# Altium project PCB_Project.PrjPcb (part 4 of 11)

## Sheet УШЯИ.411618.029Э Э3 Лист 2.schdoc
size 594 x 420 mm; SheetNumber: 2; SheetTotal: 7
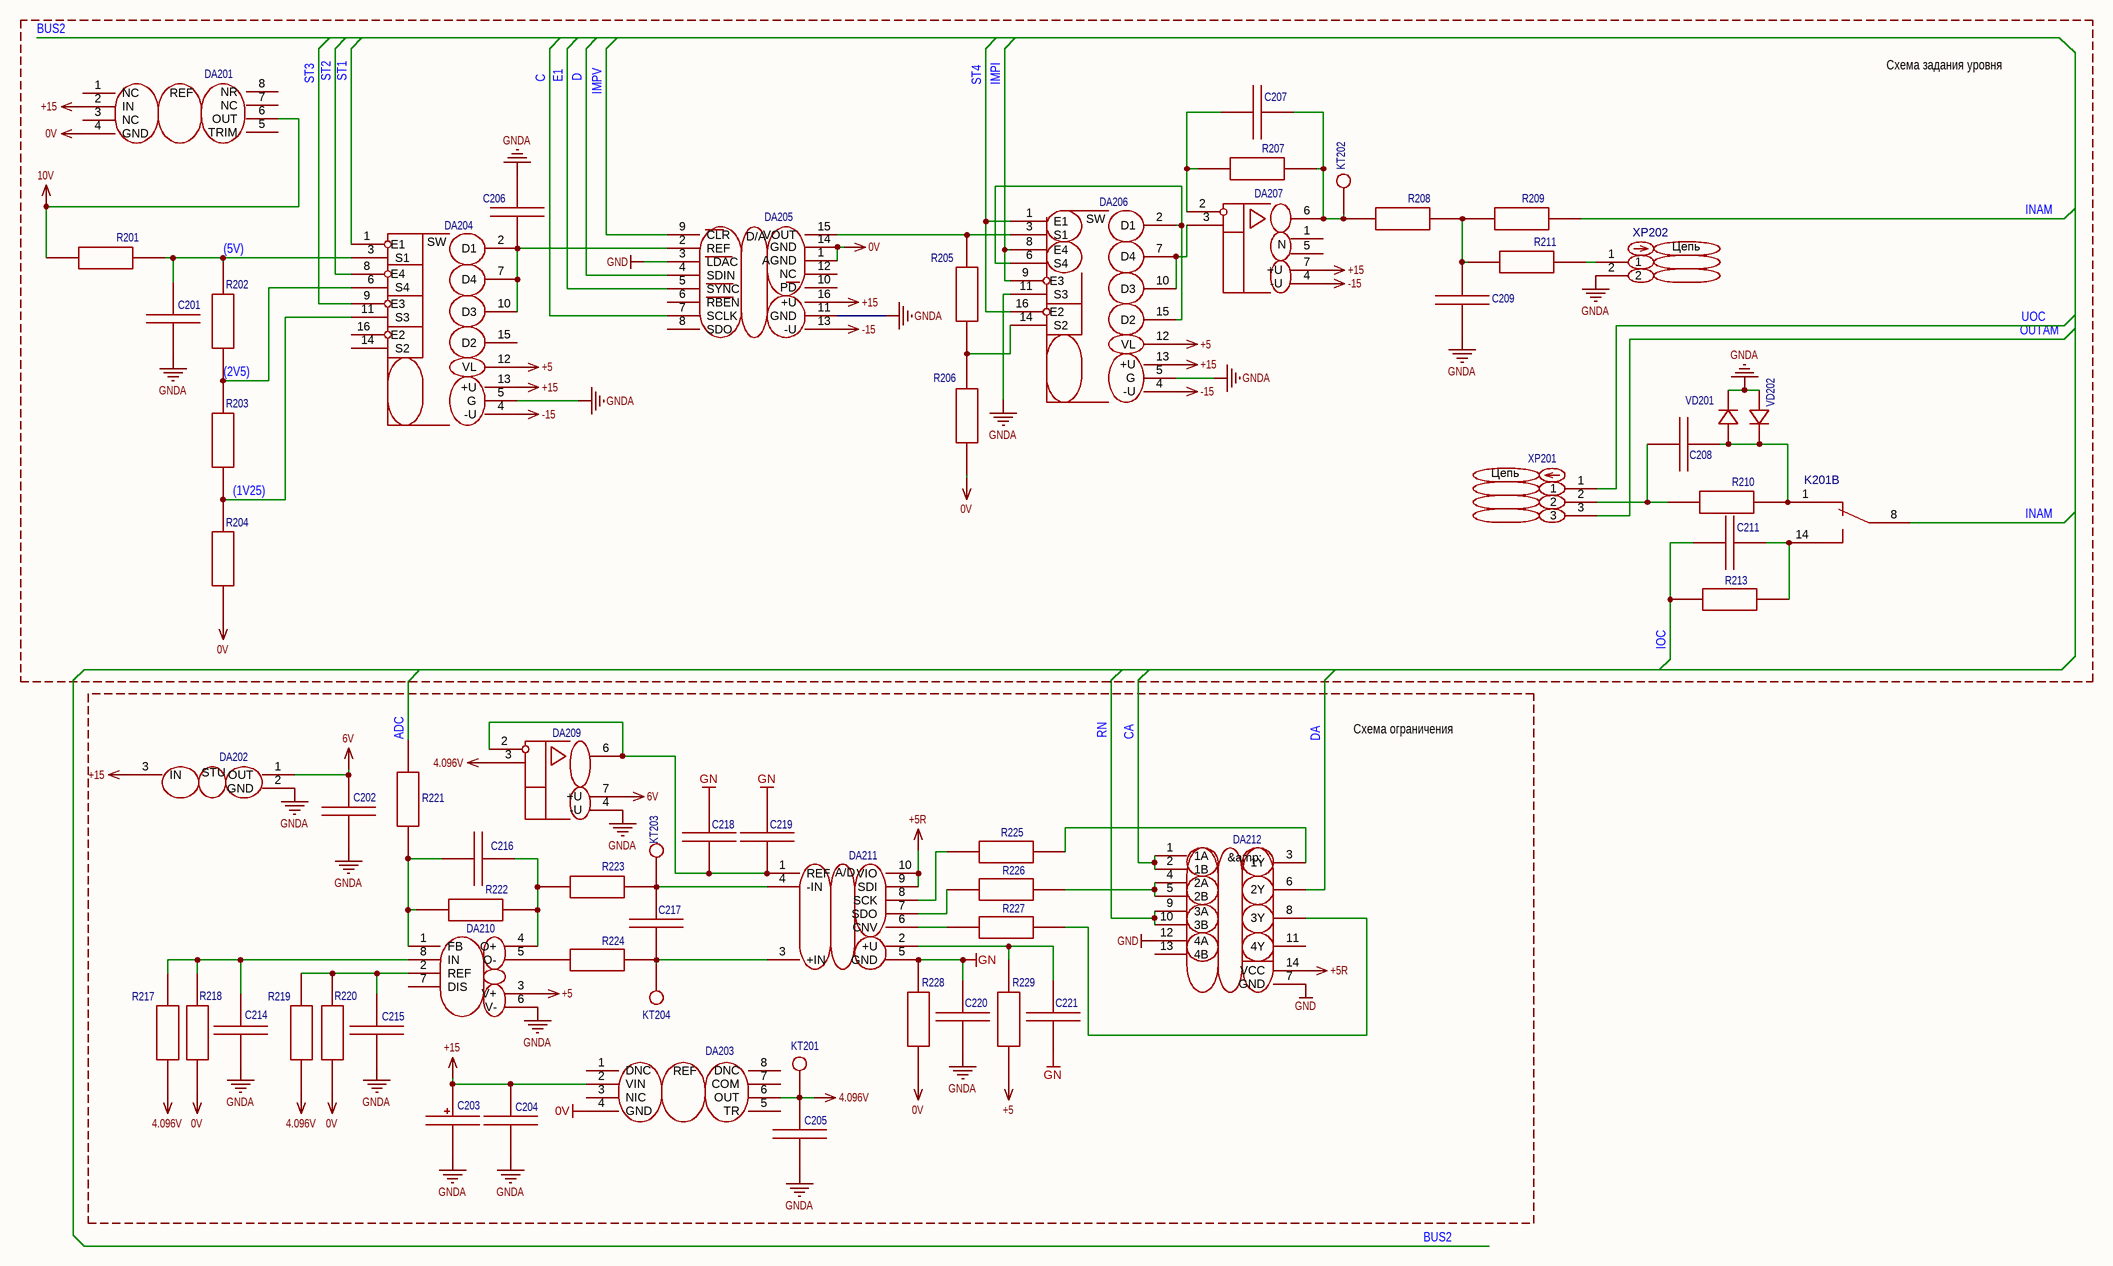
[diagram p2: УШЯИ.411618.029Э Э3 Лист 2.schdoc]

### Parts
(Parts that share a designator on the sheet are numbered #1, #2 ... from top to bottom, then left to right.)
C201  Конденсатор SMD 100нФ 100В X7R 10% [0805]  [C0805]  (value not drawn)
C202  Конденсатор SMD 0.33мкФ 100В X7R 10% [0805]  [C0805]  (value not drawn)
C203  TECAP, 4.7мкФ, 35В, тип C  [CASE-C_6032]  (value not drawn)
C204  Конденсатор SMD 0.33мкФ 100В X7R 10% [0805]  [C0805]  (value not drawn)
C205  Конденсатор SMD 100нФ 100В X7R 10% [0805]  [C0805]  (value not drawn)
C206  Конденсатор SMD 100нФ 100В X7R 10% [0805]  [C0805]  (value not drawn)
C207  Конденсатор SMD 10пФ 100В X7R 10% [0805]  [C0805]  (value not drawn)
C208  Конденсатор SMD 33пФ 100В X7R 10% [0805]  [C0805]  (value not drawn)
C209  Конденсатор SMD 5600пФ 100В X7R 10% [0805]  [C0805]  (value not drawn)
C211  Конденсатор SMD 22пФ 100В X7R 10% [0805]  [C0805]  (value not drawn)
C214  Конденсатор SMD 100нФ 100В X7R 10% [0805]  [C0805]  (value not drawn)
C215  Конденсатор SMD 100нФ 100В X7R 10% [0805]  [C0805]  (value not drawn)
C216  Конденсатор SMD 680пФ 100В X7R 10% [0805]  [C0805]  (value not drawn)
C217  Конденсатор SMD 9100пФ 100В X7R 10% [0805]  [C0805]  (value not drawn)
C218  Конденсатор SMD 1мкФ 100В X7R 10% [1206]  [C1206]  (value not drawn)
C219  Конденсатор SMD 1мкФ 100В X7R 10% [1206]  [C1206]  (value not drawn)
C220  Конденсатор SMD 1500пФ 100В X7R 10% [0805]  [C0805]  (value not drawn)
C221  Конденсатор SMD 2,2мкФ 100В X7R 10% [0805]  [C0805]  (value not drawn)
DA201  Источник опорного напряжения AD587KNZ [DIP-8]  [PDIP-8_L9.3-W6.4-P2.54-LS7.9-BL-1]  (value not drawn)
DA202  Стабилизатор напряжения 78L06-300 [SOT-89]  [SOT-89-3_L4.5-W2.5-P1.50-LS4.2-BR]  (value not drawn)
DA203  Источник опопрного напряжения 4.096 V ADR434 [SOIC-8]  [SOIC-8_L4.9-W3.9-P1.27-LS6.0-BL]  (value not drawn)
DA204  Коммутатор аналоговых сигналов ADG431BRZ [SOIC-16]  [SOIC-16_L9.9-W3.9-P1.27-LS6.0-BL]  (value not drawn)
DA205  Цифроаналоговый преобразователь AD5531BRUZ [TSSOP-16]  [TSSOP-16_L5.0-W4.4-P0.65-LS6.4-BL]  (value not drawn)
DA206  Коммутатор аналоговых сигналов ADG433BRZ [SOIC-16]  [SOIC-16_L9.9-W3.9-P1.27-LS6.0-BL]  (value not drawn)
DA207  Операционный усилитель ADA4627-1BRZ [SOIC-8]  [SOIC-8_L5.0-W4.0-P1.27-LS6.1-BL]  (value not drawn)
DA209  Операционный усилитель AD8031 [SOIC-8]  [SOIC-8_L4.9-W3.9-P1.27-LS6.0-BL]  (value not drawn)
DA210  Дифференциальный драйвер 18-разрядных АЦП ADA4941-1YRZ [SOIC-8]  [SOIC-8_L4.9-W3.9-P1.27-LS6.0-BL]  (value not drawn)
DA211  Дифференциальный АЦП АD7691 [MSOP-10]  [MSOP-10_L3.0-W3.0-P0.50-LS4.9-TL]  (value not drawn)
DA212  Логическая функция 2И 74HC08D,653 [SO-14]  [SOIC-14_L8.7-W3.9-P1.27-LS6.0-BL]  (value not drawn)
K201#2  Реле герконовое DIP05-1C90-51L [PCB]  [Реле герконовое DIP05-1C90-51L [PCB]]  (value not drawn)  (part B of 2)
KT201  Control point  (value not drawn)
KT202  Control point  (value not drawn)
KT203  Control point  (value not drawn)
KT204  Control point  (value not drawn)
R201  Резистор 10кОм 0.25Вт 1% [1206]  [R1206]  (value not drawn)
R202  Резистор 4,99кОм 0.25Вт 1% [1206]  [R1206]  (value not drawn)
R203  Резистор 2,49кОм 0.25Вт 1% [1206]  [R1206]  (value not drawn)
R204  Резистор 2,49кОм 0.25Вт 1% [1206]  [R1206]  (value not drawn)
R205  Резистор 9,09кОм 0.25Вт 1% [1206]  [R1206]  (value not drawn)
R206  Резистор 1кОм 0.25Вт 1% [1206]  [R1206]  (value not drawn)
R207  Резистор 120Ом 0.125Вт 1% [0805]  [R0805]  (value not drawn)
R208  Резистор 3,83кОм 0.25Вт 1% [1206]  [R1206]  (value not drawn)
R209  Резистор 4,99кОм 0.25Вт 1% [1206]  [R1206]  (value not drawn)
R210  Резистор 40,2кОм 0.25Вт 1% [1206]  [R1206]  (value not drawn)
R211  Резистор 3,83кОм 0.25Вт 1% [1206]  [R1206]  (value not drawn)
R213  Резистор 2кОм 0.25Вт 1% [1206]  [R1206]  (value not drawn)
R217  Резистор 24,9кОм 0.25Вт 1% [1206]  [R1206]  (value not drawn)
R218  Резистор 11,8кОм 0.25Вт 1% [1206]  [R1206]  (value not drawn)
R219  Резистор 24,9кОм 0.25Вт 1% [1206]  [R1206]  (value not drawn)
R220  Резистор 30,1кОм 0.25Вт 1% [1206]  [R1206]  (value not drawn)
R221  Резистор 20кОм 0.25Вт 1% [1206]  [R1206]  (value not drawn)
R222  Резистор 14кОм 0.25Вт 1% [1206]  [R1206]  (value not drawn)
R223  Резистор 33Ом 0,125Вт 1% [0805]  [R1206]  (value not drawn)
R224  Резистор 33Ом 0,125Вт 1% [0805]  [R1206]  (value not drawn)
R225  Резистор 33Ом 0,125Вт 1% [0805]  [R0805]  (value not drawn)
R226  Резистор 33Ом 0,125Вт 1% [0805]  [R0805]  (value not drawn)
R227  Резистор 33Ом 0,125Вт 1% [0805]  [R0805]  (value not drawn)
R228  Резистор 22Ом 0,125Вт 1% [0805]  [R0805]  (value not drawn)
R229  Резистор 15Ом 0,125Вт 1% [0805]  [R0805]  (value not drawn)
VD201  Диод импульсный 1N4448 [SOD-123]  [SOD-123_L2.7-W1.6-LS3.7-RD-1]  (value not drawn)
VD202  Диод импульсный 1N4448 [SOD-123]  [SOD-123_L2.7-W1.6-LS3.7-RD-1]  (value not drawn)
XP201  Вилка на плату 826629-3 шаг 2.54мм  [HDR-TH_3P-P2.54-V-M-1]  (value not drawn)
XP202  Вилка на плату 280370-2 шаг 2.54мм  [CONN-TH_280370-2]  (value not drawn)

### Blocks framed on the sheet
Схема задания уровня: C201 C206-C209 C211 DA201 DA204-DA207 K201#2 KT202 R201-R211 R213 VD201 VD202 XP201 XP202
Схема ограничения: C202-C205 C214-C221 DA202 DA203 DA209-DA212 KT201 KT203 KT204 R217-R229

### Nets
0V: DA201.4(GND) DA203.4(GND) DA205.1(AGND) DA205.14(GND) R204.1 R206.1 R218.1 R220.1 R228.1
4.096V: C205.1 DA203.6(OUT) DA209.3(+IN) KT201.1 R217.1 R219.1
6V: C202.1 DA202.1(OUT) DA209.7(+U)
10V: DA201.6(OUT) R201.2
+5: DA204.12(VL) DA206.12(VL) DA210.3(V+) R229.1
+5R: DA211.9(SDI) DA211.10(VIO) DA212.14(VCC)
+15: C203.1 C204.1 DA201.2(IN) DA202.3(IN) DA203.2(VIN) DA204.13(+U) DA205.16(+U) DA206.13(+U) DA207.7(+U)
-15: DA204.4(-U) DA205.13(-U) DA206.4(-U) DA207.4(-U)
GN: C218.2 C219.2 C220.2 C221.1 DA211.5(GND) R228.2
GND: DA205.3(LDAC) DA212.7(GND) DA212.12(4A)
GNDA: C201.2 C202.2 C203.2 C204.2 C205.2 C206.1 C209.1 C214.2 C215.2 C220.1 DA202.2(GND) DA204.5(G) DA205.11(GND) DA206.5(G) DA206.11(S3) DA209.4(-U) DA210.6(V-) VD201.1(C) VD202.2(A) XP202.2
IOC: C211.1 R213.1
UOC: XP201.1
(1V25): DA204.11(S3) R203.1 R204.2
(2V5): DA204.6(S4) R202.1 R203.2
(5V): C201.1 DA204.3(S1) R201.1 R202.2
ADC: R221.2
C: DA205.7(SCLK)
CA: DA212.1(1A) DA212.2(1B)
D: DA205.4(SDIN)
DA: DA212.6(2Y)
E1: DA205.5(SYNC)
IMPI: DA206.8(E4) DA206.9(E3)
IMPV: DA205.9(CLR)
INAM: K201#2.8 R209.2
OUTAM: XP201.3
RN: DA212.9(3A) DA212.10(3B)
ST1: DA204.1(E1)
ST2: DA204.8(E4)
ST3: DA204.9(E3)
ST4: DA206.1(E1) DA206.16(E2)
NetC206_2: C206.2 DA204.2(D1) DA204.7(D4) DA204.10(D3) DA205.2(REF)
NetC207_1: C207.1 DA207.2(-IN) R207.1
NetC207_2: C207.2 DA207.6(OUT) KT202.1 R207.2 R208.1
NetC208_1: C208.1 R210.1 XP201.2
NetC208_2: C208.2 K201#2.1 R210.2 VD201.2(A) VD202.1(C)
NetC209_2: C209.2 R208.2 R209.1 R211.2
NetC211_2: C211.2 K201#2.14 R213.2
NetC214_1: C214.1 DA210.8(IN) R217.2 R218.2
NetC215_1: C215.1 DA210.2(REF) R219.2 R220.2
NetC216_1: C216.1 DA210.1(FB) R221.1 R222.1
NetC216_2: C216.2 DA210.4(O+) R222.2 R223.2
NetC217_1: C217.1 DA211.3(+IN) KT204.1 R224.1
NetC217_2: C217.2 DA211.4(-IN) KT203.1 R223.1
NetC218_1: C218.1 C219.1 DA209.2(-IN) DA209.6(OUT) DA211.1(REF)
NetC221_2: C221.2 DA211.2(+U) R229.2
NetDA205_15: DA205.15(VOUT) DA206.3(S1) R205.2
NetDA206_2: DA206.2(D1) DA206.6(S4) DA206.15(D2)
NetDA206_7: DA206.7(D4) DA206.10(D3) DA207.3(+IN)
NetDA206_14: DA206.14(S2) R205.1 R206.2
NetDA210_5: DA210.5(O-) R224.2
NetDA211_6: DA211.6(CNV) R227.2
NetDA211_7: DA211.7(SDO) R226.2
NetDA211_8: DA211.8(SCK) R225.2
NetDA212_3: DA212.3(1Y) R225.1
NetDA212_4: DA212.4(2A) DA212.5(2B) R226.1
NetDA212_8: DA212.8(3Y) R227.1
NetR211_1: R211.1 XP202.1

Not connected (* = marked no-connect by the designer): DA201 1(NC) 3(NC) 5(TRIM) 7(NC) 8(NR); DA203 1(DNC) 3(NIC) 5(TR) 7(COM) 8(DNC); DA204 14(S2) 15(D2) 16(E2); DA205 6(RBEN) 8(SDO) 10(PD) 12(NC); DA207 1(N) 5(N); DA210 7(DIS); DA212 11(4Y) 13(4B)

### Buses and harness runs
bus BUS2

### Notes on the sheet
- Подп. и дата
- Инв.№ дубл.
- Взам.инв.№
- Подп.и дата
- Инв.№ подл.
- Изм.
- Лист
- № докум.
- Подп.
- Дата
- Формат  A2
- (in symbol Вилка на плату 280370-2 шаг 2.54мм) Цепь
- (in symbol Вилка на плату 826629-3 шаг 2.54мм) Цепь
- (in symbol Дифференциальный АЦП АD7691 [MSOP-10]) A/D
- (in symbol Источник опопрного напряжения 4.096 V ADR434 [SOIC-8]) REF
- (in symbol Источник опорного напряжения AD587KNZ [DIP-8]) REF
- (in symbol Коммутатор аналоговых сигналов ADG431BRZ [SOIC-16]) SW
- (in symbol Коммутатор аналоговых сигналов ADG433BRZ [SOIC-16]) SW
- (in symbol Логическая функция 2И 74HC08D,653 [SO-14]) &amp;
- (in symbol Стабилизатор напряжения 78L06-300 [SOT-89]) STU
- (in symbol Цифроаналоговый преобразователь AD5531BRUZ [TSSOP-16]) D/A

### Library data of the parts
C201 = Конденсатор SMD 100нФ 100В X7R 10% [0805]: Contributor: jordanjin; Convert to PCB: yes; UniqueId: gge610d07ec82ed99e2; Origin Footprint: C0805; Device: Конденсатор SMD 100нФ 100В X7R 10% [0805]; Symbol: Конденсатор SMD 100нФ 100В X7R 10% [0805]; Manufacturer Part: C0805; spicePre: C; spiceSymbolName: Конденсатор SMD 100нФ 100В X7R 10% [0805]; Add into BOM: yes; FootprintName: C0805
C202 = Конденсатор SMD 0.33мкФ 100В X7R 10% [0805]: Contributor: jordanjin; Convert to PCB: yes; UniqueId: gge3027680270fc1593; Origin Footprint: C0805; Device: Конденсатор SMD 0.33мкФ 100В X7R 10% [0805]; Symbol: Конденсатор SMD 0.33мкФ 100В X7R 10% [0805]; Manufacturer Part: C0805; spicePre: C; spiceSymbolName: Конденсатор SMD 100нФ 100В X7R 10% [0805]; Add into BOM: yes; FootprintName: C0805
C203 = TECAP, 4.7мкФ, 35В, тип C: Manufacturer: Kyocera AVX; Manufacturer Part: TECAP, 100мкФ, 10В, тип C; nameAlias: Value; Contributor: jordanjin; Convert to PCB: yes; UniqueId: ggeb894a7cfd837db3e; Origin Footprint: CASE-C_6032; Device: TECAP, 4.7мкФ, 35В, тип C; Symbol: TECAP, 4.7мкФ, 35В, тип C; Supplier: LCSC; Supplier Part: C273664; JLCPCB Part Class: Extended Part; spicePre: C; spiceSymbolName: TECAP, 100мкФ, 10В, тип C; Add into BOM: yes; FootprintName: CASE-C_6032
C204 = Конденсатор SMD 0.33мкФ 100В X7R 10% [0805]: Contributor: jordanjin; Convert to PCB: yes; UniqueId: gge98cf81a33b76d68b; Origin Footprint: C0805; Device: Конденсатор SMD 0.33мкФ 100В X7R 10% [0805]; Symbol: Конденсатор SMD 0.33мкФ 100В X7R 10% [0805]; Manufacturer Part: C0805; spicePre: C; spiceSymbolName: Конденсатор SMD 100нФ 100В X7R 10% [0805]; Add into BOM: yes; FootprintName: C0805
C205 = Конденсатор SMD 100нФ 100В X7R 10% [0805]: Contributor: jordanjin; Convert to PCB: yes; UniqueId: gge757bc79d223d3177; Origin Footprint: C0805; Device: Конденсатор SMD 100нФ 100В X7R 10% [0805]; Symbol: Конденсатор SMD 100нФ 100В X7R 10% [0805]; Manufacturer Part: C0805; spicePre: C; spiceSymbolName: Конденсатор SMD 100нФ 100В X7R 10% [0805]; Add into BOM: yes; FootprintName: C0805
C206 = Конденсатор SMD 100нФ 100В X7R 10% [0805]: Contributor: jordanjin; Convert to PCB: yes; UniqueId: gge9c67a6bb4fcd2d0a; Origin Footprint: C0805; Device: Конденсатор SMD 100нФ 100В X7R 10% [0805]; Symbol: Конденсатор SMD 100нФ 100В X7R 10% [0805]; Manufacturer Part: C0805; spicePre: C; spiceSymbolName: Конденсатор SMD 100нФ 100В X7R 10% [0805]; Add into BOM: yes; FootprintName: C0805
C207 = Конденсатор SMD 10пФ 100В X7R 10% [0805]: Contributor: jordanjin; Convert to PCB: yes; UniqueId: gge6408d63cc853d407; Origin Footprint: C0805; Device: Конденсатор SMD 10пФ 100В X7R 10% [0805]; Symbol: Конденсатор SMD 10пФ 100В X7R 10% [0805]; Manufacturer Part: C0805; spicePre: C; spiceSymbolName: Конденсатор SMD 100нФ 100В X7R 10% [0805]; Add into BOM: yes; FootprintName: C0805
C208 = Конденсатор SMD 33пФ 100В X7R 10% [0805]: Contributor: jordanjin; Convert to PCB: yes; UniqueId: gge74ff06e723770230; Origin Footprint: C0805; Device: Конденсатор SMD 33пФ 100В X7R 10% [0805]; Symbol: Конденсатор SMD 33пФ 100В X7R 10% [0805]; Manufacturer Part: C0805; spicePre: C; spiceSymbolName: Конденсатор SMD 100нФ 100В X7R 10% [0805]; Add into BOM: yes; FootprintName: C0805
C209 = Конденсатор SMD 5600пФ 100В X7R 10% [0805]: Contributor: jordanjin; Convert to PCB: yes; UniqueId: ggee35e904d9e45dcff; Origin Footprint: C0805; Device: Конденсатор SMD 5600пФ 100В X7R 10% [0805]; Symbol: Конденсатор SMD 5600пФ 100В X7R 10% [0805]; Manufacturer Part: C0805; spicePre: C; spiceSymbolName: Конденсатор SMD 100нФ 100В X7R 10% [0805]; Add into BOM: yes; FootprintName: C0805
C211 = Конденсатор SMD 47пФ 100В X7R 10% [0805]: Contributor: jordanjin; Convert to PCB: yes; UniqueId: ggebcdf9166f131ad3e; Origin Footprint: C0805; Device: Конденсатор SMD 47пФ 100В X7R 10% [0805]; Symbol: Конденсатор SMD 47пФ 100В X7R 10% [0805]; Manufacturer Part: C0805; spicePre: C; spiceSymbolName: Конденсатор SMD 100нФ 100В X7R 10% [0805]; Add into BOM: yes; FootprintName: C0805
C214 = Конденсатор SMD 100нФ 100В X7R 10% [0805]: Contributor: jordanjin; Convert to PCB: yes; UniqueId: ggef6da372763917921; Origin Footprint: C0805; Device: Конденсатор SMD 100нФ 100В X7R 10% [0805]; Symbol: Конденсатор SMD 100нФ 100В X7R 10% [0805]; Manufacturer Part: C0805; spicePre: C; spiceSymbolName: Конденсатор SMD 100нФ 100В X7R 10% [0805]; Add into BOM: yes; FootprintName: C0805
C215 = Конденсатор SMD 100нФ 100В X7R 10% [0805]: Contributor: jordanjin; Convert to PCB: yes; UniqueId: gge84b8ee80d83a6db3; Origin Footprint: C0805; Device: Конденсатор SMD 100нФ 100В X7R 10% [0805]; Symbol: Конденсатор SMD 100нФ 100В X7R 10% [0805]; Manufacturer Part: C0805; spicePre: C; spiceSymbolName: Конденсатор SMD 100нФ 100В X7R 10% [0805]; Add into BOM: yes; FootprintName: C0805
C216 = Конденсатор SMD 680пФ 100В X7R 10% [0805]: Contributor: jordanjin; Convert to PCB: yes; UniqueId: ggee46bcfb34e487613; Origin Footprint: C0805; Device: Конденсатор SMD 680пФ 100В X7R 10% [0805]; Symbol: Конденсатор SMD 680пФ 100В X7R 10% [0805]; Manufacturer Part: C0805; spicePre: C; spiceSymbolName: Конденсатор SMD 100нФ 100В X7R 10% [0805]; Add into BOM: yes; FootprintName: C0805
C217 = Конденсатор SMD 9100пФ 100В X7R 10% [0805]: Contributor: jordanjin; Convert to PCB: yes; UniqueId: ggeaca6435958f86383; Origin Footprint: C0805; Device: Конденсатор SMD 9100пФ 100В X7R 10% [0805]; Symbol: Конденсатор SMD 9100пФ 100В X7R 10% [0805]; Manufacturer Part: C0805; spicePre: C; spiceSymbolName: Конденсатор SMD 100нФ 100В X7R 10% [0805]; Add into BOM: yes; FootprintName: C0805
C218 = Конденсатор SMD 1мкФ 100В X7R 10% [1206]: Contributor: jordanjin; Convert to PCB: yes; UniqueId: gge7874448dced5ad97; Origin Footprint: C1206; Device: Конденсатор SMD 1мкФ 100В X7R 10% [1206]; Symbol: Конденсатор SMD 1мкФ 100В X7R 10% [1206]; Manufacturer Part: C1206; spicePre: C; spiceSymbolName: Конденсатор SMD 100нФ 100В X7R 10% [1206]; Add into BOM: yes; FootprintName: C1206
C219 = Конденсатор SMD 1мкФ 100В X7R 10% [1206]: Contributor: jordanjin; Convert to PCB: yes; UniqueId: ggeeff5ebe028285b3e; Origin Footprint: C1206; Device: Конденсатор SMD 1мкФ 100В X7R 10% [1206]; Symbol: Конденсатор SMD 1мкФ 100В X7R 10% [1206]; Manufacturer Part: C1206; spicePre: C; spiceSymbolName: Конденсатор SMD 100нФ 100В X7R 10% [1206]; Add into BOM: yes; FootprintName: C1206
C220 = Конденсатор SMD 1500пФ 100В X7R 10% [0805]: Contributor: jordanjin; Convert to PCB: yes; UniqueId: gge738013eea0431644; Origin Footprint: C0805; Device: Конденсатор SMD 1500пФ 100В X7R 10% [0805]; Symbol: Конденсатор SMD 1500пФ 100В X7R 10% [0805]; Manufacturer Part: C0805; spicePre: C; spiceSymbolName: Конденсатор SMD 100нФ 100В X7R 10% [0805]; Add into BOM: yes; FootprintName: C0805
C221 = Конденсатор SMD 2,2мкФ 100В X7R 10% [0805]: Contributor: jordanjin; Convert to PCB: yes; UniqueId: gge0d32fd6a7c96d400; Origin Footprint: C0805; Device: Конденсатор SMD 2,2мкФ 100В X7R 10% [0805]; Symbol: Конденсатор SMD 2,2мкФ 100В X7R 10% [0805]; Manufacturer Part: C0805; spicePre: C; spiceSymbolName: Конденсатор SMD 100нФ 100В X7R 10% [0805]; Add into BOM: yes; FootprintName: C0805
DA201 = Источник опорного напряжения AD587KNZ [DIP-8]: Manufacturer: Analog Devices; Contributor: jordanjin; Convert to PCB: yes; UniqueId: gge3ea31b7bc5ba7302; ModelId: 0a905fe212f04dd58d97e47ae0145e08; Origin Footprint: PDIP-8_L9.3-W6.4-P2.54-LS7.9-BL-1; Device: Источник опорного напряжения AD587KNZ [DIP-8]; Symbol: Источник опорного напряжения AD587KNZ [DIP-8]; Supplier: LCSC; Manufacturer Part: AD587KNZ; JLCPCB Part Class: Extended Part; spicePre: D; spiceSymbolName: Источник опорного напряжения AD587KNZ [DIP-8]; Add into BOM: yes; FootprintName: PDIP-8_L9.3-W6.4-P2.54-LS7.9-BL-1; ModelName: PDIP-8_L9.3-W6.4-P2.54-LS7.9-BL-1
DA202 = Стабилизатор напряжения 78L06-300 [SOT-89]: Manufacturer: UMW; Contributor: jordanjin; Convert to PCB: yes; UniqueId: gge7fb4a5574cb8e1f8; Origin Footprint: SOT-89-3_L4.5-W2.5-P1.50-LS4.2-BR; Device: Стабилизатор напряжения 78L06-300 [SOT-89]; Symbol: Стабилизатор напряжения 78L06-300 [SOT-89]; Supplier: LCSC; Manufacturer Part: 78L06-300; JLCPCB Part Class: Extended Part; spicePre: D; spiceSymbolName: Стабилизатор напряжения 78L06-300 [SOT-89]; Add into BOM: yes; FootprintName: SOT-89-3_L4.5-W2.5-P1.50-LS4.2-BR
DA203 = Источник опопрного напряжения 4.096 V ADR434 [SOIC-8]: Manufacturer: Analog Devices; Contributor: jordanjin; Convert to PCB: yes; UniqueId: ggeae212be344de7ac5; Origin Footprint: SOIC-8_L4.9-W3.9-P1.27-LS6.0-BL; Device: Источник опопрного напряжения 4.096 V ADR434 [SOIC-8]; Symbol: Источник опопрного напряжения 4.096 V ADR434 [SOIC-8]; Supplier: LCSC; Manufacturer Part: ADR434; JLCPCB Part Class: Extended Part; spicePre: D; spiceSymbolName: Источник опопрного напряжения 4.096 V ADR434 [SOIC-8]; Add into BOM: yes; FootprintName: SOIC-8_L4.9-W3.9-P1.27-LS6.0-BL
DA204 = Коммутатор аналоговых сигналов ADG431BRZ [SOIC-16]: Manufacturer: Analog Devices; Contributor: jordanjin; Convert to PCB: yes; UniqueId: gge69d42b7b9fe55c41; Origin Footprint: SOIC-16_L9.9-W3.9-P1.27-LS6.0-BL; Device: Коммутатор аналоговых сигналов ADG431BRZ [SOIC-16]; Symbol: Коммутатор аналоговых сигналов ADG431BRZ [SOIC-16]; Supplier: LCSC; Supplier Part: C208635; Manufacturer Part: ADG431BRZ; JLCPCB Part Class: Extended Part; spicePre: D; spiceSymbolName: Коммутатор аналоговых сигналов ADG431BRZ [SOIC-16]; Add into BOM: yes; FootprintName: SOIC-16_L9.9-W3.9-P1.27-LS6.0-BL
DA205 = Цифроаналоговый преобразователь AD5531BRUZ [TSSOP-16]: Manufacturer: Analog Devices; Manufacturer Part: AD5531BRUZ-REEL7; Contributor: jordanjin; Convert to PCB: yes; UniqueId: gge0e7443f72cb61633; Origin Footprint: TSSOP-16_L5.0-W4.4-P0.65-LS6.4-BL; Device: Цифроаналоговый преобразователь AD5531BRUZ [TSSOP-16]; Symbol: Цифроаналоговый преобразователь AD5531BRUZ [TSSOP-16]; Supplier: LCSC; Supplier Part: C578208; JLCPCB Part Class: Extended Part; spicePre: D; spiceSymbolName: Цифроаналоговый преобразователь AD5531BRUZ [TSSOP-16]; Add into BOM: yes; FootprintName: TSSOP-16_L5.0-W4.4-P0.65-LS6.4-BL
DA206 = Коммутатор аналоговых сигналов ADG433BRZ [SOIC-16]: Manufacturer: Analog Devices; Manufacturer Part: ADG433BRZ-REEL; Contributor: jordanjin; Convert to PCB: yes; UniqueId: gge4be3ddaa9aa1b4ea; Origin Footprint: SOIC-16_L9.9-W3.9-P1.27-LS6.0-BL; Device: Коммутатор аналоговых сигналов ADG433BRZ [SOIC-16]; Symbol: Коммутатор аналоговых сигналов ADG433BRZ [SOIC-16]; Supplier: LCSC; Supplier Part: C655338; JLCPCB Part Class: Extended Part; spicePre: D; spiceSymbolName: Коммутатор аналоговых сигналов ADG433BRZ [SOIC-16]; Add into BOM: yes; FootprintName: SOIC-16_L9.9-W3.9-P1.27-LS6.0-BL
DA207 = Операционный усилитель ADA4627-1BRZ [SOIC-8]: Manufacturer: Analog Devices; Contributor: jordanjin; Convert to PCB: yes; UniqueId: gge5d573c7ee08cf7f6; ModelId: 08ee08ca4db744298953d7a1ad16709b; Origin Footprint: SOIC-8_L5.0-W4.0-P1.27-LS6.1-BL; Device: Операционный усилитель ADA4627-1BRZ [SOIC-8]; Symbol: Операционный усилитель ADA4627-1BRZ [SOIC-8]; Supplier: LCSC; Manufacturer Part: ADA4627-1BRZ; JLCPCB Part Class: Extended Part; spicePre: D; spiceSymbolName: Операционный усилитель ADA4627-1BRZ [SOIC-8]; Add into BOM: yes; FootprintName: SOIC-8_L5.0-W4.0-P1.27-LS6.1-BL; ModelName: SOIC-8_L5.0-W4.0-P1.27-LS6.1-BL
DA209 = Операционный усилитель AD8031 [SOIC-8]: Manufacturer: Analog Devices; Manufacturer Part: AD8031BRZ-REEL7; Contributor: jordanjin; Convert to PCB: yes; UniqueId: gge62cd891aac0fc93c; Origin Footprint: SOIC-8_L4.9-W3.9-P1.27-LS6.0-BL; Device: Операционный усилитель AD8031 [SOIC-8]; Symbol: Операционный усилитель AD8031 [SOIC-8]; Supplier: LCSC; Supplier Part: C56309; JLCPCB Part Class: Extended Part; spicePre: D; spiceSymbolName: Операционный усилитель AD8031 [SOIC-8]; Add into BOM: yes; FootprintName: SOIC-8_L4.9-W3.9-P1.27-LS6.0-BL
DA210 = Дифференциальный драйвер 18-разрядных АЦП ADA4941-1YRZ [SOIC-8]: Manufacturer: Analog Devices; Contributor: jordanjin; Convert to PCB: yes; UniqueId: ggeec733bf2f64a91bf; Origin Footprint: SOIC-8_L4.9-W3.9-P1.27-LS6.0-BL; Device: Дифференциальный драйвер 18-разрядных АЦП ADA4941-1YRZ [SOIC-8]; Symbol: Дифференциальный драйвер 18-разрядных АЦП ADA4941-1YRZ [SOIC-8]; Supplier: LCSC; Manufacturer Part: ADA4941-1YRZ; JLCPCB Part Class: Extended Part; spicePre: D; spiceSymbolName: Дифференциальный драйвер 18-разрядных АЦП ADA4941-1YRZ [SOIC-8]; Add into BOM: yes; FootprintName: SOIC-8_L4.9-W3.9-P1.27-LS6.0-BL
DA211 = Дифференциальный АЦП АD7691 [MSOP-10]: Manufacturer: Analog Devices; Contributor: jordanjin; Convert to PCB: yes; UniqueId: gge26c0700bfbd06f0d; ModelId: 8dddc987df624b228af477f4d4234e3c; Origin Footprint: MSOP-10_L3.0-W3.0-P0.50-LS4.9-TL; Device: Дифференциальный АЦП АD7691 [MSOP-10]; Symbol: Дифференциальный АЦП АD7691 [MSOP-10]; spicePre: D; spiceSymbolName: Дифференциальный АЦП АD7691 [MSOP-10]; Add into BOM: yes; FootprintName: MSOP-10_L3.0-W3.0-P0.50-LS4.9-TL; ModelName: MSOP-10_L3.0-W3.0-P0.50-LS4.9-TL
DA212 = Логическая функция 2И 74HC08D,653 [SO-14]: Manufacturer: Nexperia; Contributor: jordanjin; Convert to PCB: yes; UniqueId: gge10e058de012b6629; Origin Footprint: SOIC-14_L8.7-W3.9-P1.27-LS6.0-BL; Device: Логическая функция 2И 74HC08D,653 [SO-14]; Symbol: Логическая функция 2И 74HC08D,653 [SO-14]; Supplier: LCSC; Manufacturer Part: 74HC08D,653; JLCPCB Part Class: Extended Part; spicePre: D; spiceSymbolName: Логическая функция 2И 74HC08D,653 [SO-14]; Add into BOM: yes; FootprintName: SOIC-14_L8.7-W3.9-P1.27-LS6.0-BL
K201#2 = Реле герконовое DIP05-1C90-51L [PCB]: Manufacturer: STANDEXMEDER; subpart_no: 1; Origin Footprint: RELAY-TH_STANDEXMEDER_DIP05-1C90-51L; Contributor: jordanjin; Convert to PCB: yes; UniqueId: gge6178cdef53ee876f; ModelId: 9ce20f042c4243a9be1ebcff3b9f4bf9; Device: Реле герконовое DIP05-1C90-51L [PCB]; Symbol: Реле герконовое DIP05-1C90-51L [PCB]; Supplier: LCSC; Manufacturer Part: DIP05-1C90-51L; JLCPCB Part Class: Extended Part; spicePre: K; spiceSymbolName: Реле герконовое DIP05-1C90-51L [PCB]; Add into BOM: yes; FootprintName: RELAY-TH_STANDEXMEDER_DIP05-1C90-51L; ModelName: RELAY-TH_STANDEXMEDER_DIP05-1C90-51L
KT201 = Control point: Contributor: jordanjin; Convert to PCB: yes; UniqueId: ggef98eb2457b3a2db3; Origin Footprint: CONTROL POINT; Device: Control point; Symbol: Control point; Manufacturer Part: Control point; spicePre: K; spiceSymbolName: Control point; Add into BOM: yes
KT202 = Control point: Contributor: jordanjin; Convert to PCB: yes; UniqueId: gge7292ed09fd448b11; Origin Footprint: CONTROL POINT; Device: Control point; Symbol: Control point; Manufacturer Part: Control point; spicePre: K; spiceSymbolName: Control point; Add into BOM: yes
KT203 = Control point: Contributor: jordanjin; Convert to PCB: yes; UniqueId: gge883ca878b3b38f22; Origin Footprint: CONTROL POINT; Device: Control point; Symbol: Control point; Manufacturer Part: Control point; spicePre: K; spiceSymbolName: Control point; Add into BOM: yes
KT204 = Control point: Contributor: jordanjin; Convert to PCB: yes; UniqueId: gge961df7385aab1647; Origin Footprint: CONTROL POINT; Device: Control point; Symbol: Control point; Manufacturer Part: Control point; spicePre: K; spiceSymbolName: Control point; Add into BOM: yes
R201 = Резистор 10кОм 0.25Вт 1% [1206]: Contributor: jordanjin; Convert to PCB: yes; UniqueId: gge7d518c35428b98fb; Origin Footprint: R1206; Device: Резистор 10кОм 0.25Вт 1% [1206]; Symbol: Резистор 10кОм 0.25Вт 1% [1206]; Manufacturer Part: R1206; spicePre: R; spiceSymbolName: Резистор 12кОм 0,25Вт 1% [1206]; Add into BOM: yes; FootprintName: R1206
R202 = Резистор 4,99кОм 0.25Вт 1% [1206]: Contributor: jordanjin; Convert to PCB: yes; UniqueId: gge589878778ccb2ddd; Origin Footprint: R1206; Device: Резистор 4,99кОм 0.25Вт 1% [1206]; Symbol: Резистор 4,99кОм 0.25Вт 1% [1206]; Manufacturer Part: R1206; spicePre: R; spiceSymbolName: Резистор 12кОм 0,25Вт 1% [1206]; Add into BOM: yes; FootprintName: R1206
R203 = Резистор 2,49кОм 0.25Вт 1% [1206]: Contributor: jordanjin; Convert to PCB: yes; UniqueId: gge078efca5cbc8d300; Origin Footprint: R1206; Device: Резистор 2,49кОм 0.25Вт 1% [1206]; Symbol: Резистор 2,49кОм 0.25Вт 1% [1206]; Manufacturer Part: R1206; spicePre: R; spiceSymbolName: Резистор 12кОм 0,25Вт 1% [1206]; Add into BOM: yes; FootprintName: R1206
R204 = Резистор 2,49кОм 0.25Вт 1% [1206]: Contributor: jordanjin; Convert to PCB: yes; UniqueId: gge3a96a5cf86464f58; Origin Footprint: R1206; Device: Резистор 2,49кОм 0.25Вт 1% [1206]; Symbol: Резистор 2,49кОм 0.25Вт 1% [1206]; Manufacturer Part: R1206; spicePre: R; spiceSymbolName: Резистор 12кОм 0,25Вт 1% [1206]; Add into BOM: yes; FootprintName: R1206
R205 = Резистор 9,09кОм 0.25Вт 1% [1206]: Contributor: jordanjin; Convert to PCB: yes; UniqueId: ggef612ea4179644b48; Origin Footprint: R1206; Device: Резистор 9,09кОм 0.25Вт 1% [1206]; Symbol: Резистор 9,09кОм 0.25Вт 1% [1206]; Manufacturer Part: R1206; spicePre: R; spiceSymbolName: Резистор 12кОм 0,25Вт 1% [1206]; Add into BOM: yes; FootprintName: R1206
R206 = Резистор 1кОм 0.25Вт 1% [1206]: Contributor: jordanjin; Convert to PCB: yes; UniqueId: gge32a1e07cca9df901; Origin Footprint: R1206; Device: Резистор 1кОм 0.25Вт 1% [1206]; Symbol: Резистор 1кОм 0.25Вт 1% [1206]; Manufacturer Part: R1206; spicePre: R; spiceSymbolName: Резистор 12кОм 0,25Вт 1% [1206]; Add into BOM: yes; FootprintName: R1206
R207 = Резистор 120Ом 0.125Вт 1% [0805]: Contributor: jordanjin; Convert to PCB: yes; UniqueId: ggec09913ea7eed3e21; ModelId: de27d504f5024d53a3020ec2611f5e5e; Origin Footprint: R0805; Device: Резистор 120Ом 0.125Вт 1% [0805]; Symbol: Резистор 120Ом 0.125Вт 1% [0805]; Manufacturer Part: R0805; spicePre: R; spiceSymbolName: Резистор 12кОм 0,25Вт 1% [1206]; Add into BOM: yes; FootprintName: R0805; ModelName: R0805
R208 = Резистор 3,83кОм 0.25Вт 1% [1206]: Contributor: jordanjin; Convert to PCB: yes; UniqueId: gge8a5aa154aa04bbdd; Origin Footprint: R1206; Device: Резистор 3,83кОм 0.25Вт 1% [1206]; Symbol: Резистор 3,83кОм 0.25Вт 1% [1206]; Manufacturer Part: R1206; spicePre: R; spiceSymbolName: Резистор 12кОм 0,25Вт 1% [1206]; Add into BOM: yes; FootprintName: R1206
R209 = Резистор 4,99кОм 0.25Вт 1% [1206]: Contributor: jordanjin; Convert to PCB: yes; UniqueId: gge0b815d0e47bf766f; Origin Footprint: R1206; Device: Резистор 4,99кОм 0.25Вт 1% [1206]; Symbol: Резистор 4,99кОм 0.25Вт 1% [1206]; Manufacturer Part: R1206; spicePre: R; spiceSymbolName: Резистор 12кОм 0,25Вт 1% [1206]; Add into BOM: yes; FootprintName: R1206
R210 = Резистор 40,2кОм 0.25Вт 1% [1206]: Contributor: jordanjin; Convert to PCB: yes; UniqueId: ggec73dbedad6f0ecfe; Origin Footprint: R1206; Device: Резистор 40,2кОм 0.25Вт 1% [1206]; Symbol: Резистор 40,2кОм 0.25Вт 1% [1206]; Manufacturer Part: R1206; spicePre: R; spiceSymbolName: Резистор 12кОм 0,25Вт 1% [1206]; Add into BOM: yes; FootprintName: R1206
R211 = Резистор 3,83кОм 0.25Вт 1% [1206]: Contributor: jordanjin; Convert to PCB: yes; UniqueId: ggec56ea112b2cd7263; Origin Footprint: R1206; Device: Резистор 3,83кОм 0.25Вт 1% [1206]; Symbol: Резистор 3,83кОм 0.25Вт 1% [1206]; Manufacturer Part: R1206; spicePre: R; spiceSymbolName: Резистор 12кОм 0,25Вт 1% [1206]; Add into BOM: yes; FootprintName: R1206
R213 = Резистор 402Ом 0.25Вт 1% [1206]: Contributor: jordanjin; Convert to PCB: yes; UniqueId: gged6c32bc60b8fe393; Origin Footprint: R1206; Device: Резистор 402Ом 0.25Вт 1% [1206]; Symbol: Резистор 402Ом 0.25Вт 1% [1206]; Manufacturer Part: R1206; spicePre: R; spiceSymbolName: Резистор 12кОм 0,25Вт 1% [1206]; Add into BOM: yes; FootprintName: R1206
R217 = Резистор 24,9кОм 0.25Вт 1% [1206]: Contributor: jordanjin; Convert to PCB: yes; UniqueId: ggef60ac22bde86f3e6; Origin Footprint: R1206; Device: Резистор 24,9кОм 0.25Вт 1% [1206]; Symbol: Резистор 24,9кОм 0.25Вт 1% [1206]; Manufacturer Part: R1206; spicePre: R; spiceSymbolName: Резистор 12кОм 0,25Вт 1% [1206]; Add into BOM: yes; FootprintName: R1206
R218 = Резистор 11,8кОм 0.25Вт 1% [1206]: Contributor: jordanjin; Convert to PCB: yes; UniqueId: ggeb8daf8ef1d3139e0; Origin Footprint: R1206; Device: Резистор 11,8кОм 0.25Вт 1% [1206]; Symbol: Резистор 11,8кОм 0.25Вт 1% [1206]; Manufacturer Part: R1206; spicePre: R; spiceSymbolName: Резистор 12кОм 0,25Вт 1% [1206]; Add into BOM: yes; FootprintName: R1206
R219 = Резистор 24,9кОм 0.25Вт 1% [1206]: Contributor: jordanjin; Convert to PCB: yes; UniqueId: gge53ffcd035831015b; Origin Footprint: R1206; Device: Резистор 24,9кОм 0.25Вт 1% [1206]; Symbol: Резистор 24,9кОм 0.25Вт 1% [1206]; Manufacturer Part: R1206; spicePre: R; spiceSymbolName: Резистор 12кОм 0,25Вт 1% [1206]; Add into BOM: yes; FootprintName: R1206
R220 = Резистор 30,1кОм 0.25Вт 1% [1206]: Contributor: jordanjin; Convert to PCB: yes; UniqueId: ggec87a57a96243f491; Origin Footprint: R1206; Device: Резистор 30,1кОм 0.25Вт 1% [1206]; Symbol: Резистор 30,1кОм 0.25Вт 1% [1206]; Manufacturer Part: R1206; spicePre: R; spiceSymbolName: Резистор 12кОм 0,25Вт 1% [1206]; Add into BOM: yes; FootprintName: R1206
R221 = Резистор 20кОм 0.25Вт 1% [1206]: Contributor: jordanjin; Convert to PCB: yes; UniqueId: gge53adf15c978c91af; Origin Footprint: R1206; Device: Резистор 20кОм 0.25Вт 1% [1206]; Symbol: Резистор 20кОм 0.25Вт 1% [1206]; Manufacturer Part: R1206; spicePre: R; spiceSymbolName: Резистор 12кОм 0,25Вт 1% [1206]; Add into BOM: yes; FootprintName: R1206
R222 = Резистор 14кОм 0.25Вт 1% [1206]: Contributor: jordanjin; Convert to PCB: yes; UniqueId: gge5b30a2df6d1a0edd; Origin Footprint: R1206; Device: Резистор 14кОм 0.25Вт 1% [1206]; Symbol: Резистор 14кОм 0.25Вт 1% [1206]; Manufacturer Part: R1206; spicePre: R; spiceSymbolName: Резистор 12кОм 0,25Вт 1% [1206]; Add into BOM: yes; FootprintName: R1206
R223 = Резистор 33Ом 0,125Вт 1% [0805]: Contributor: jordanjin; Convert to PCB: yes; UniqueId: gge62f4812832a07bf9; Origin Footprint: R1206; Device: Резистор 33Ом 0,125Вт 1% [0805]; Symbol: Резистор 33Ом 0,125Вт 1% [0805]; Manufacturer Part: R1206; spicePre: R; spiceSymbolName: Резистор 12кОм 0,25Вт 1% [1206]; Add into BOM: yes; FootprintName: R1206
R224 = Резистор 33Ом 0,125Вт 1% [0805]: Contributor: jordanjin; Convert to PCB: yes; UniqueId: gge656d60c37132ad6e; Origin Footprint: R1206; Device: Резистор 33Ом 0,125Вт 1% [0805]; Symbol: Резистор 33Ом 0,125Вт 1% [0805]; Manufacturer Part: R1206; spicePre: R; spiceSymbolName: Резистор 12кОм 0,25Вт 1% [1206]; Add into BOM: yes; FootprintName: R1206
R225 = Резистор 33Ом 0,125Вт 1% [0805]: Contributor: jordanjin; Convert to PCB: yes; UniqueId: ggeff7e93c13db49d2e; ModelId: de27d504f5024d53a3020ec2611f5e5e; Origin Footprint: R0805; Device: Резистор 33Ом 0,125Вт 1% [0805]; Symbol: Резистор 33Ом 0,125Вт 1% [0805]; Manufacturer Part: R0805; spicePre: R; spiceSymbolName: Резистор 12кОм 0,125Вт 1% [0805]; Add into BOM: yes; FootprintName: R0805; ModelName: R0805
R226 = Резистор 33Ом 0,125Вт 1% [0805]: Contributor: jordanjin; Convert to PCB: yes; UniqueId: ggecb27557eec313eea; ModelId: de27d504f5024d53a3020ec2611f5e5e; Origin Footprint: R0805; Device: Резистор 33Ом 0,125Вт 1% [0805]; Symbol: Резистор 33Ом 0,125Вт 1% [0805]; Manufacturer Part: R0805; spicePre: R; spiceSymbolName: Резистор 12кОм 0,125Вт 1% [0805]; Add into BOM: yes; FootprintName: R0805; ModelName: R0805
R227 = Резистор 33Ом 0,125Вт 1% [0805]: Contributor: jordanjin; Convert to PCB: yes; UniqueId: ggeca7bef7df240af7e; ModelId: de27d504f5024d53a3020ec2611f5e5e; Origin Footprint: R0805; Device: Резистор 33Ом 0,125Вт 1% [0805]; Symbol: Резистор 33Ом 0,125Вт 1% [0805]; Manufacturer Part: R0805; spicePre: R; spiceSymbolName: Резистор 12кОм 0,125Вт 1% [0805]; Add into BOM: yes; FootprintName: R0805; ModelName: R0805
R228 = Резистор 22Ом 0,125Вт 1% [0805]: Contributor: jordanjin; Convert to PCB: yes; UniqueId: ggede35cff75efacecb; ModelId: de27d504f5024d53a3020ec2611f5e5e; Origin Footprint: R0805; Device: Резистор 22Ом 0,125Вт 1% [0805]; Symbol: Резистор 22Ом 0,125Вт 1% [0805]; Manufacturer Part: R0805; spicePre: R; spiceSymbolName: Резистор 12кОм 0,125Вт 1% [0805]; Add into BOM: yes; FootprintName: R0805; ModelName: R0805
R229 = Резистор 15Ом 0,125Вт 1% [0805]: Contributor: jordanjin; Convert to PCB: yes; UniqueId: ggef69317e34cb5bd2a; ModelId: de27d504f5024d53a3020ec2611f5e5e; Origin Footprint: R0805; Device: Резистор 15Ом 0,125Вт 1% [0805]; Symbol: Резистор 15Ом 0,125Вт 1% [0805]; Manufacturer Part: R0805; spicePre: R; spiceSymbolName: Резистор 12кОм 0,125Вт 1% [0805]; Add into BOM: yes; FootprintName: R0805; ModelName: R0805
VD201 = Диод импульсный 1N4448 [SOD-123]: Manufacturer: YANGJIE; Manufacturer Part: 1N4448WQ; Contributor: jordanjin; Convert to PCB: yes; UniqueId: gge57ac2feeab7c7aa3; ModelId: 5a61cd31046d4447ba73169a45a0935b; Origin Footprint: SOD-123_L2.7-W1.6-LS3.7-RD-1; Device: Диод импульсный 1N4448 [SOD-123]; Symbol: Диод импульсный 1N4448 [SOD-123]; Supplier: LCSC; JLCPCB Part Class: Extended Part; spicePre: V; spiceSymbolName: Диод импульсный 1N4448 [SOD-123]; Add into BOM: yes; FootprintName: SOD-123_L2.7-W1.6-LS3.7-RD-1; ModelName: SOD-123_L2.7-W1.6-LS3.7-RD-1
VD202 = Диод импульсный 1N4448 [SOD-123]: Manufacturer: YANGJIE; Manufacturer Part: 1N4448WQ; Contributor: jordanjin; Convert to PCB: yes; UniqueId: gge7a9557551decdd95; ModelId: 5a61cd31046d4447ba73169a45a0935b; Origin Footprint: SOD-123_L2.7-W1.6-LS3.7-RD-1; Device: Диод импульсный 1N4448 [SOD-123]; Symbol: Диод импульсный 1N4448 [SOD-123]; Supplier: LCSC; JLCPCB Part Class: Extended Part; spicePre: V; spiceSymbolName: Диод импульсный 1N4448 [SOD-123]; Add into BOM: yes; FootprintName: SOD-123_L2.7-W1.6-LS3.7-RD-1; ModelName: SOD-123_L2.7-W1.6-LS3.7-RD-1
XP201 = Вилка на плату 826629-3 шаг 2.54мм: Manufacturer: TE Connectivity; Contributor: jordanjin; Convert to PCB: yes; UniqueId: ggebe5b07cfd5f401d4; Origin Footprint: HDR-TH_3P-P2.54-V-M-1; Device: Вилка на плату 826629-3 шаг 2.54мм; Symbol: Вилка на плату 826629-3 шаг 2.54мм; Supplier: LCSC; Manufacturer Part: 826629-3; JLCPCB Part Class: Extended Part; spicePre: X; spiceSymbolName: Вилка на плату 826629-3 шаг 2.54мм; Add into BOM: yes; FootprintName: HDR-TH_3P-P2.54-V-M-1
XP202 = Вилка на плату 280370-2 шаг 2.54мм: Manufacturer: TE Connectivity; Contributor: jordanjin; Convert to PCB: yes; UniqueId: gge4bccedc3e2fefce3; ModelId: 52348b5124d84a51b365c609ac2689aa; Origin Footprint: CONN-TH_280370-2; Device: Вилка на плату 280370-2 шаг 2.54мм; Symbol: Вилка на плату 280370-2 шаг 2.54мм; Supplier: LCSC; Manufacturer Part: 280370-2; JLCPCB Part Class: Extended Part; spicePre: X; spiceSymbolName: Вилка на плату 280370-2 шаг 2.54мм; Add into BOM: yes; FootprintName: CONN-TH_280370-2; ModelName: CONN-TH_280370-2